# Altium project MotorControl-V4.5.PrjPCB
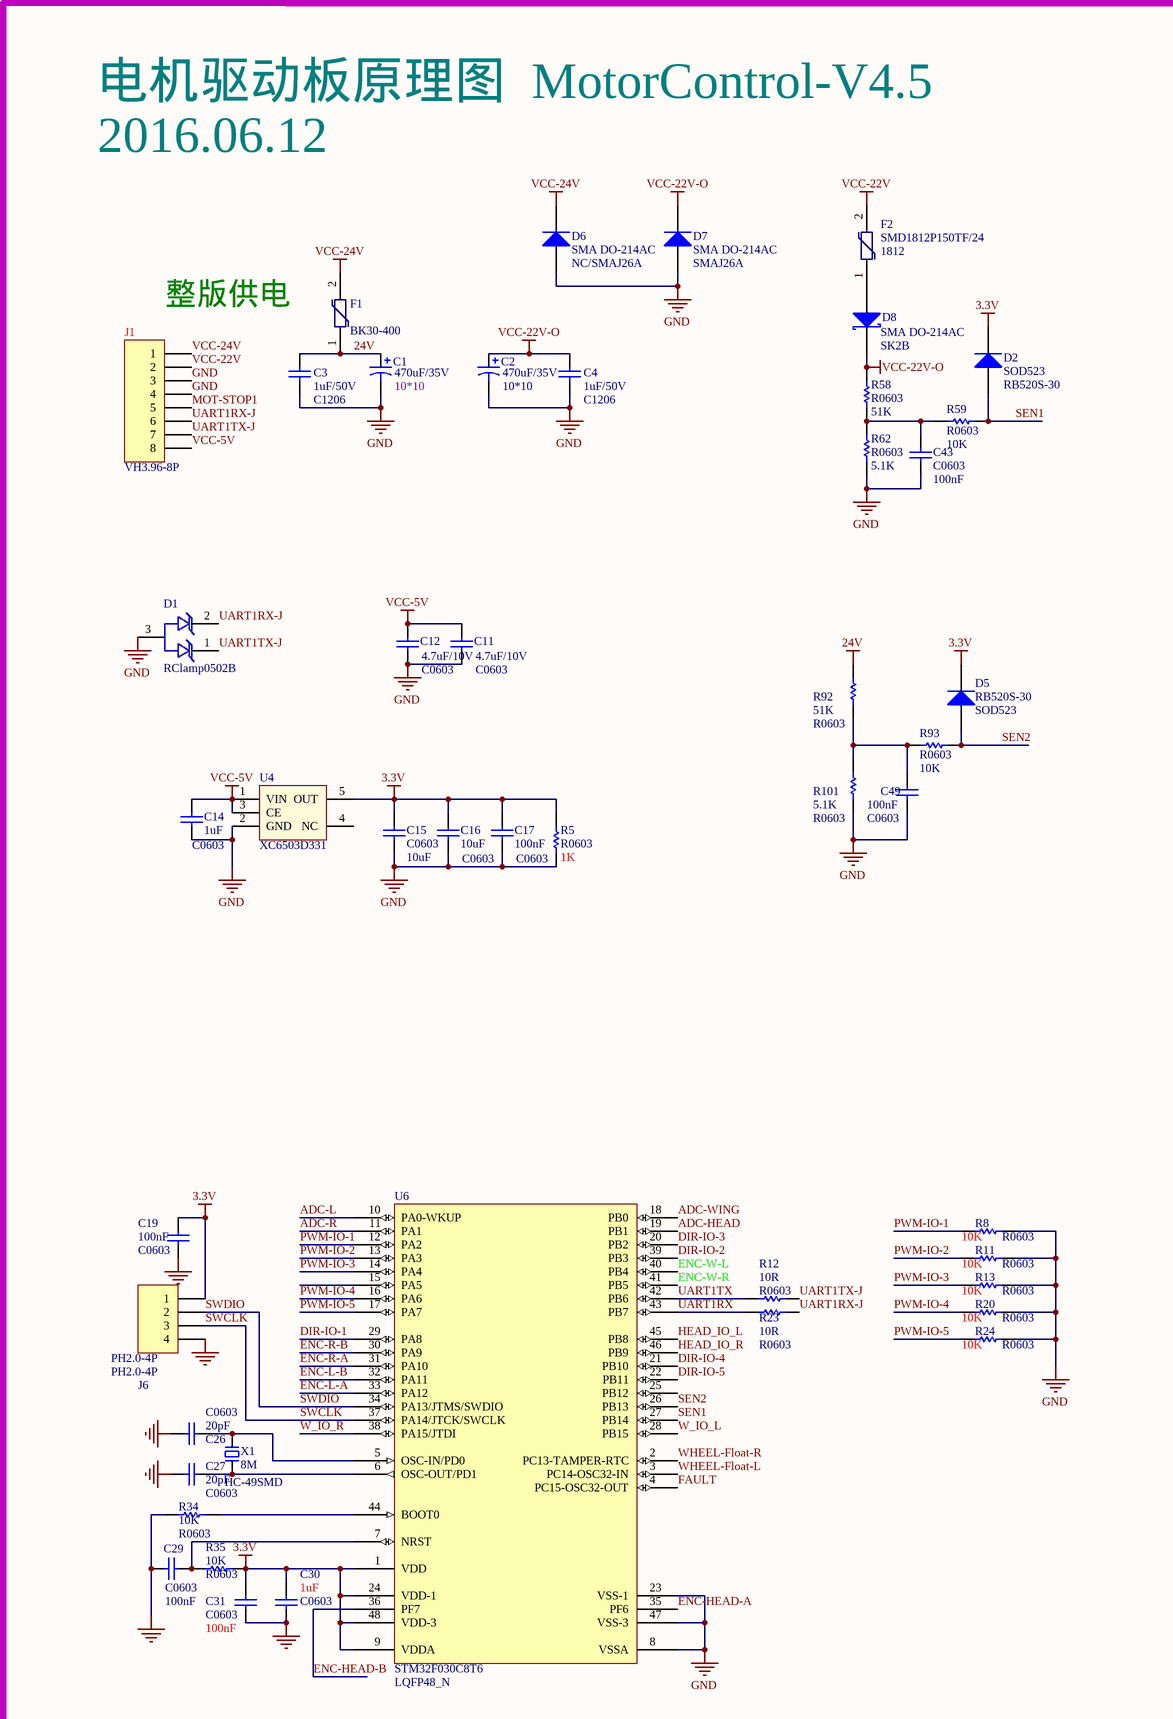
[diagram p0: MotorControlV4.5.SchDoc, top left]
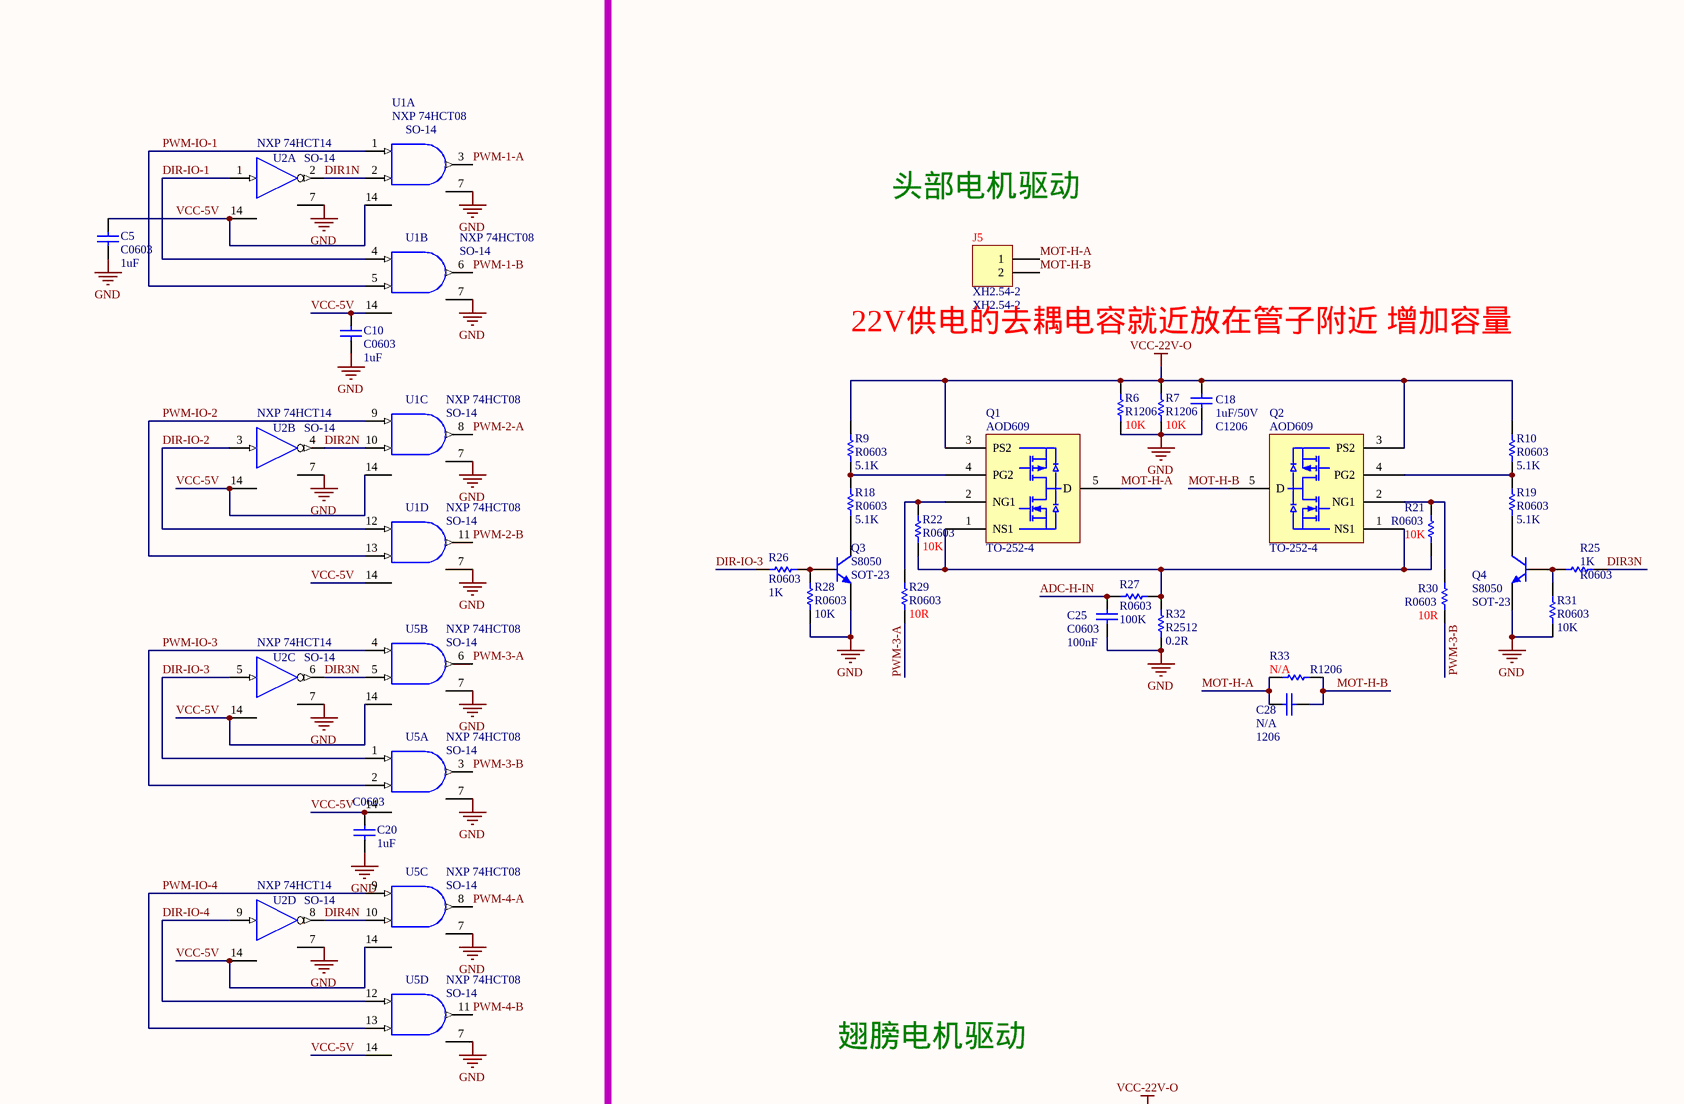
[diagram p1: MotorControlV4.5.SchDoc, top middle]
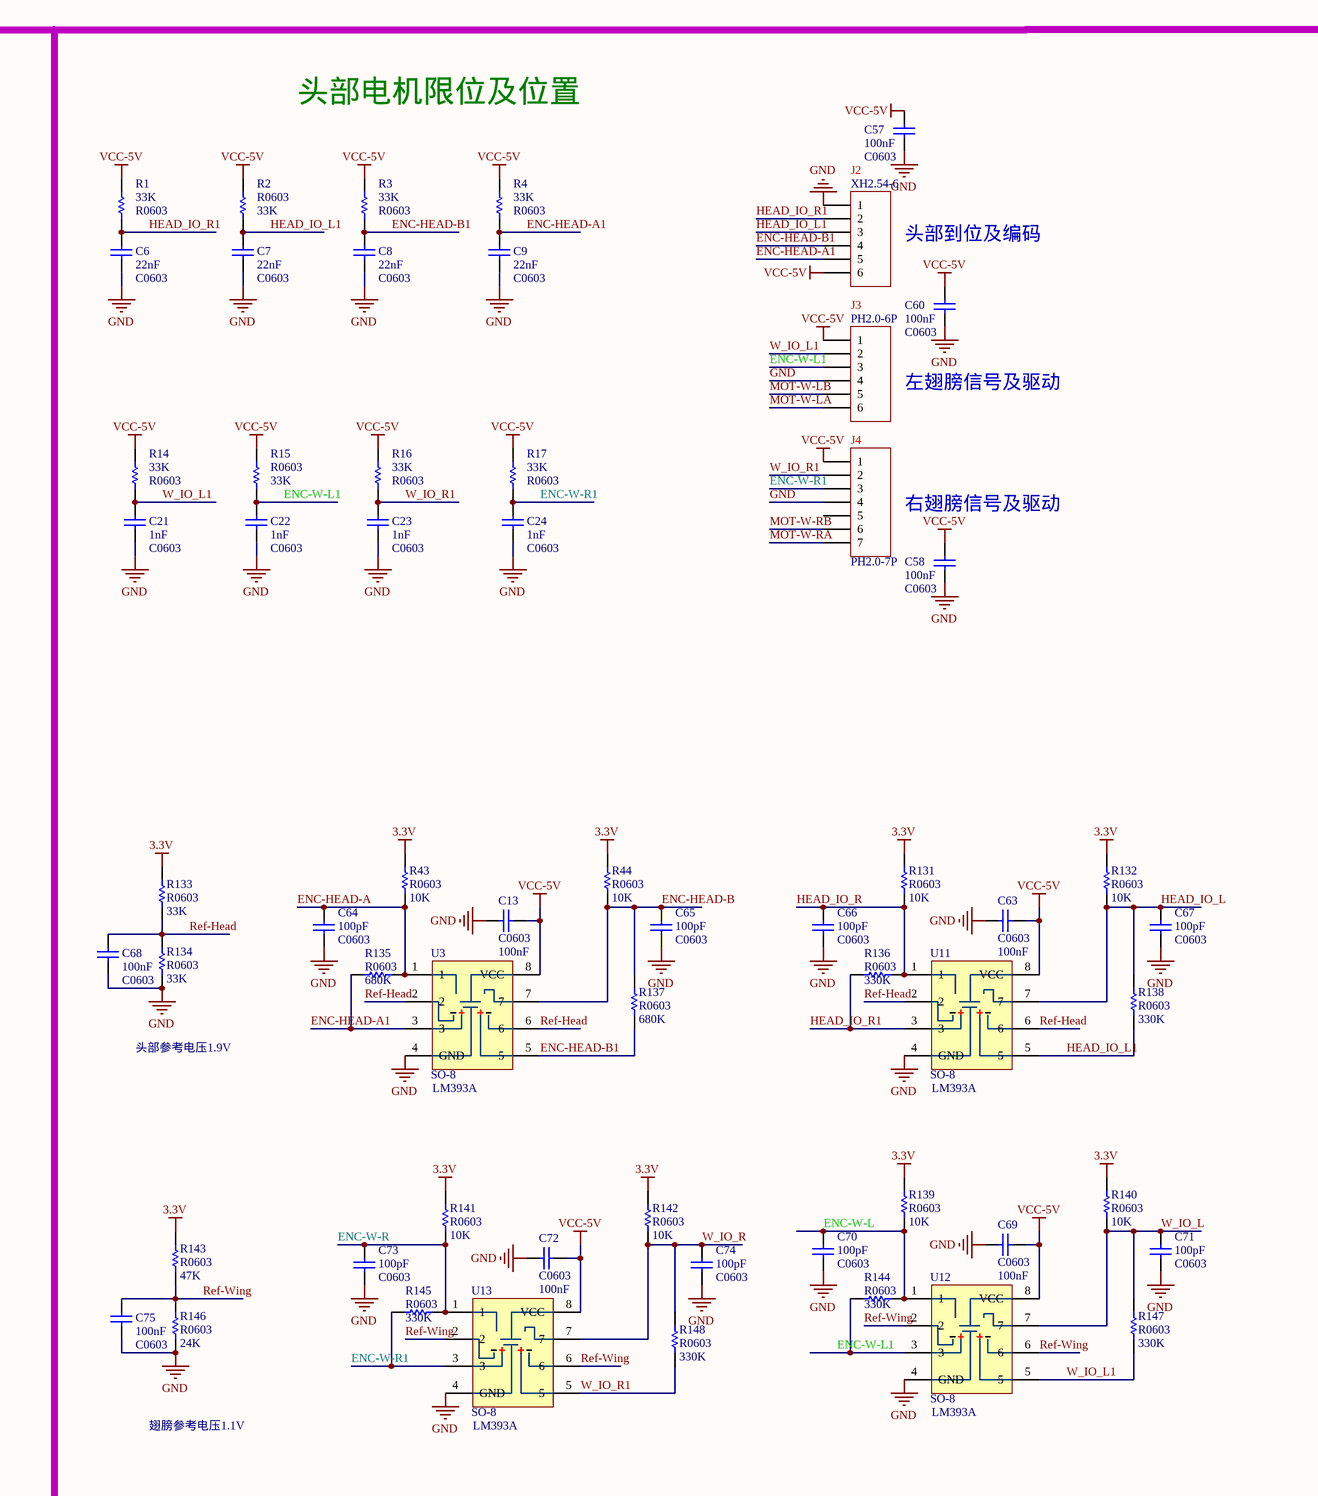
[diagram p2: MotorControlV4.5.SchDoc, top right]
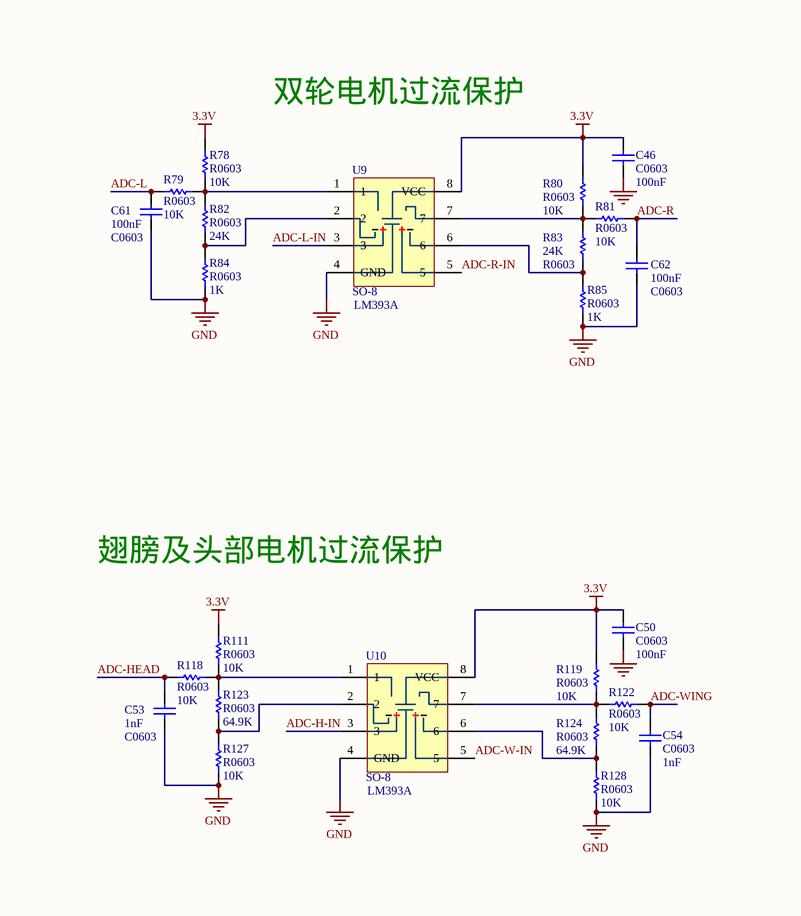
[diagram p3: MotorControlV4.5.SchDoc, bottom left]
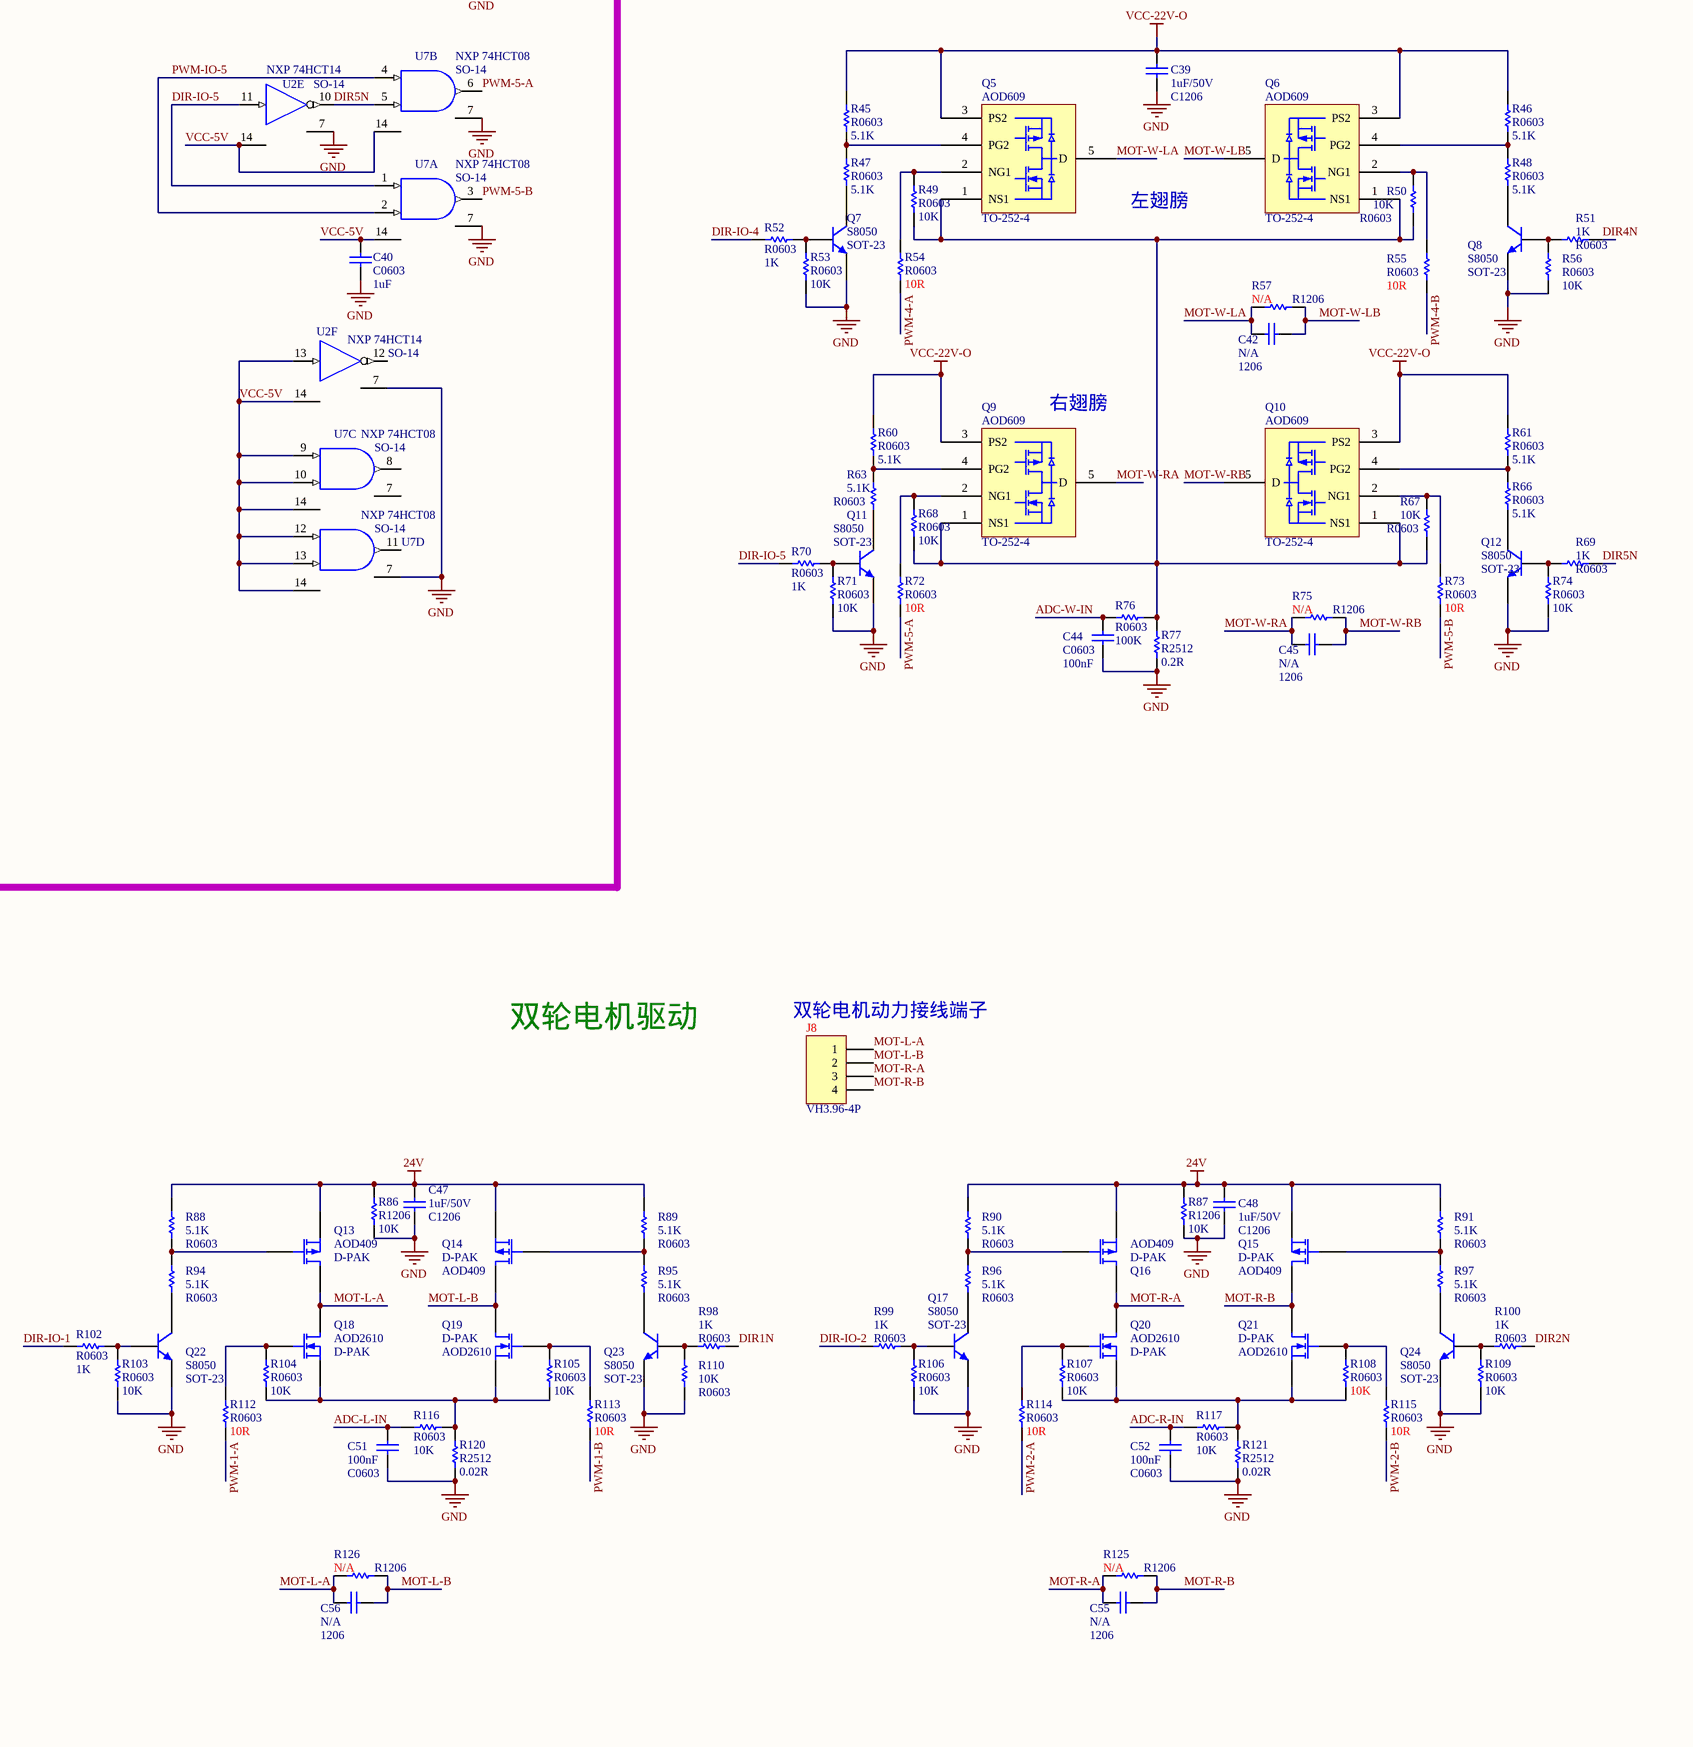
[diagram p4: MotorControlV4.5.SchDoc, bottom middle]
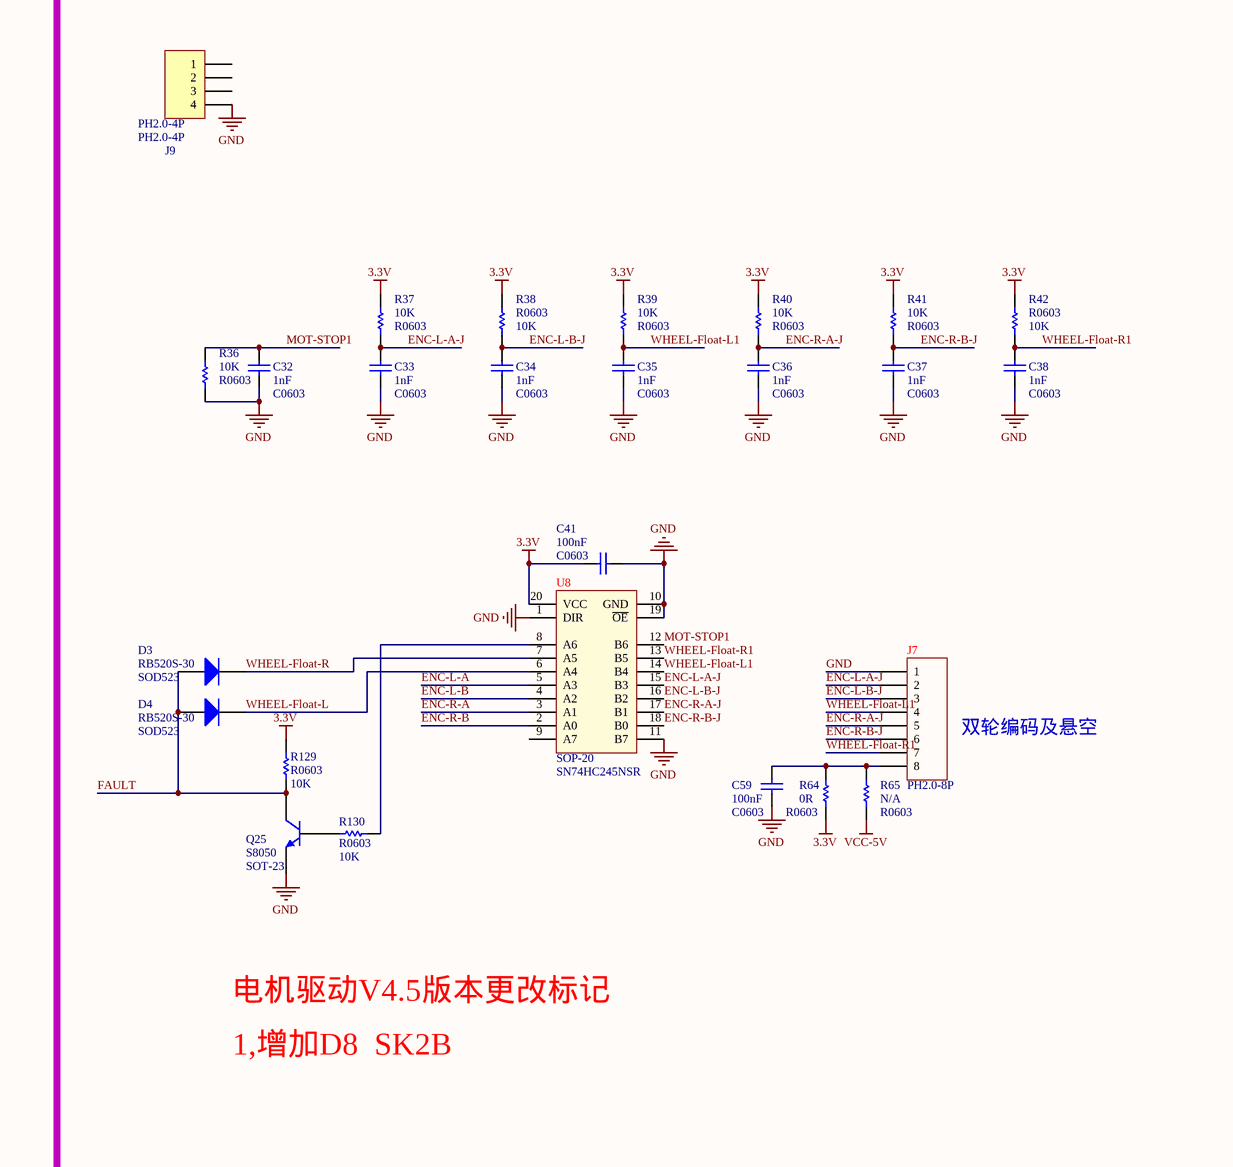
[diagram p5: MotorControlV4.5.SchDoc, bottom right]
1 sheet, 281 parts. Net scope: global (net labels, ports and power ports of the same name join across sheets).
Board file: MotorControl-V4.5.PcbDoc

## Sheet MotorControlV4.5.SchDoc
size 889 x 584 mm

### Parts
C1  470uF/35V  value 10*10  [CAP_SO_10*10]
C2  470uF/35V  value 10*10  [CAP_SO_10*10]
C3  C1206  value 1uF/50V  [1206]
C4  C1206  value 1uF/50V  [1206]
C5  C0603  value 1uF  [C0603_M1608]
C6  C0603  value 22nF  [C0603_M1608]
C7  C0603  value 22nF  [C0603_M1608]
C8  C0603  value 22nF  [C0603_M1608]
C9  C0603  value 22nF  [C0603_M1608]
C10  C0603  value 1uF  [C0603_M1608]
C11  C0603  value 4.7uF/10V  [C0603_M1608]
C12  C0603  value 4.7uF/10V  [C0603_M1608]
C13  C0603  value 100nF  [C0603_M1608]
C14  C0603  value 1uF  [C0603_M1608]
C15  C0603  value 10uF  [C0603_M1608]
C16  C0603  value 10uF  [C0603_M1608]
C17  C0603  value 100nF  [C0603_M1608]
C18  C1206  value 1uF/50V  [1206]
C19  C0603  value 100nF  [C0603_M1608]
C20  C0603  value 1uF  [C0603_M1608]
C21  C0603  value 1nF  [C0603_M1608]
C22  C0603  value 1nF  [C0603_M1608]
C23  C0603  value 1nF  [C0603_M1608]
C24  C0603  value 1nF  [C0603_M1608]
C25  C0603  value 100nF  [C0603_M1608]
C26  C0603  value 20pF  [C0603_M1608]
C27  C0603  value 20pF  [C0603_M1608]
C28  1206  [1206]
C29  C0603  value 100nF  [C0603_M1608]
C30  C0603  value 1uF  [C0603_M1608]
C31  C0603  value 100nF  [C0603_M1608]
C32  C0603  value 1nF  [C0603_M1608]
C33  C0603  value 1nF  [C0603_M1608]
C34  C0603  value 1nF  [C0603_M1608]
C35  C0603  value 1nF  [C0603_M1608]
C36  C0603  value 1nF  [C0603_M1608]
C37  C0603  value 1nF  [C0603_M1608]
C38  C0603  value 1nF  [C0603_M1608]
C39  C1206  value 1uF/50V  [1206]
C40  C0603  value 1uF  [C0603_M1608]
C41  C0603  value 100nF  [C0603_M1608]
C42  1206  [1206]
C43  C0603  value 100nF  [C0603_M1608]
C44  C0603  value 100nF  [C0603_M1608]
C45  1206  [1206]
C46  C0603  value 100nF  [C0603_M1608]
C47  C1206  value 1uF/50V  [1206]
C48  C1206  value 1uF/50V  [1206]
C49  C0603  value 100nF  [C0603_M1608]
C50  C0603  value 100nF  [C0603_M1608]
C51  C0603  value 100nF  [C0603_M1608]
C52  C0603  value 100nF  [C0603_M1608]
C53  C0603  value 1nF  [C0603_M1608]
C54  C0603  value 1nF  [C0603_M1608]
C55  1206  [1206]
C56  1206  [1206]
C57  C0603  value 100nF  [C0603_M1608]
C58  C0603  value 100nF  [C0603_M1608]
C59  C0603  value 100nF  [C0603_M1608]
C60  C0603  value 100nF  [C0603_M1608]
C61  C0603  value 100nF  [C0603_M1608]
C62  C0603  value 100nF  [C0603_M1608]
C63  C0603  value 100nF  [C0603_M1608]
C64  C0603  value 100pF  [C0603_M1608]
C65  C0603  value 100pF  [C0603_M1608]
C66  C0603  value 100pF  [C0603_M1608]
C67  C0603  value 100pF  [C0603_M1608]
C68  C0603  value 100nF  [C0603_M1608]
C69  C0603  value 100nF  [C0603_M1608]
C70  C0603  value 100pF  [C0603_M1608]
C71  C0603  value 100pF  [C0603_M1608]
C72  C0603  value 100nF  [C0603_M1608]
C73  C0603  value 100pF  [C0603_M1608]
C74  C0603  value 100pF  [C0603_M1608]
C75  C0603  value 100nF  [C0603_M1608]
D1  RClamp0502B  [SOT-523]
D2  SOD523  value RB520S-30  [SOD523]
D3  SOD523  value RB520S-30  [SOD523]
D4  SOD523  value RB520S-30  [SOD523]
D5  SOD523  value RB520S-30  [SOD523]
D6  SMA DO-214AC  value NC/SMAJ26A  [SMA DO-214AC]
D7  SMA DO-214AC  value SMAJ26A  [SMA DO-214AC]
D8  SMA DO-214AC  value SK2B  [SMA DO-214AC]
F1  BK30-400  [FUSE-FRG-5MM]
F2  1812  value SMD1812P150TF/24  [1812]
J1  VH3.96-8P  [VH3.96-8P]
J2  XH2.54-6  [XH2.54-6]
J3  PH2.0-6P  [PH2.0-6P]
J4  PH2.0-7P  [PH2.0-7P]
J5  XH2.54-2  [XH2.54-2]
J6  PH2.0-4P  [PH2.0-4P]
J7  PH2.0-8P  [PH2.0-8P]
J8  VH3.96-4P  [VH3.96-4P]
J9  PH2.0-4P  [PH2.0-4P]
Q1  TO-252-4  value AOD609  [TO-252-4L]
Q2  TO-252-4  value AOD609  [TO-252-4L]
Q3  SOT-23  value S8050  [SOT-23_L]
Q4  SOT-23  value S8050  [SOT-23_L]
Q5  TO-252-4  value AOD609  [TO-252-4L]
Q6  TO-252-4  value AOD609  [TO-252-4L]
Q7  SOT-23  value S8050  [SOT-23_L]
Q8  SOT-23  value S8050  [SOT-23_L]
Q9  TO-252-4  value AOD609  [TO-252-4L]
Q10  TO-252-4  value AOD609  [TO-252-4L]
Q11  SOT-23  value S8050  [SOT-23_L]
Q12  SOT-23  value S8050  [SOT-23_L]
Q13  D-PAK  value AOD409  [TO-252-2L]
Q14  D-PAK  value AOD409  [TO-252-2L]
Q15  D-PAK  value AOD409  [TO-252-2L]
Q16  D-PAK  value AOD409  [TO-252-2L]
Q17  SOT-23  value S8050  [SOT-23_L]
Q18  D-PAK  value AOD2610  [TO-252-2L]
Q19  D-PAK  value AOD2610  [TO-252-2L]
Q20  D-PAK  value AOD2610  [TO-252-2L]
Q21  D-PAK  value AOD2610  [TO-252-2L]
Q22  SOT-23  value S8050  [SOT-23_L]
Q23  SOT-23  value S8050  [SOT-23_L]
Q24  SOT-23  value S8050  [SOT-23_L]
Q25  SOT-23  value S8050  [SOT-23_L]
R1  R0603  value 33K  [0603]
R2  R0603  value 33K  [0603]
R3  R0603  value 33K  [0603]
R4  R0603  value 33K  [0603]
R5  R0603  value 1K  [0603]
R6  R1206  value 10K  [1206]
R7  R1206  value 10K  [1206]
R8  R0603  value 10K  [0603]
R9  R0603  value 5.1K  [0603]
R10  R0603  value 5.1K  [0603]
R11  R0603  value 10K  [0603]
R12  R0603  value 10R  [0603]
R13  R0603  value 10K  [0603]
R14  R0603  value 33K  [0603]
R15  R0603  value 33K  [0603]
R16  R0603  value 33K  [0603]
R17  R0603  value 33K  [0603]
R18  R0603  value 5.1K  [0603]
R19  R0603  value 5.1K  [0603]
R20  R0603  value 10K  [0603]
R21  R0603  value 10K  [0603]
R22  R0603  value 10K  [0603]
R23  R0603  value 10R  [0603]
R24  R0603  value 10K  [0603]
R25  R0603  value 1K  [0603]
R26  R0603  value 1K  [0603]
R27  R0603  value 100K  [0603]
R28  R0603  value 10K  [0603]
R29  R0603  value 10R  [0603]
R30  R0603  value 10R  [0603]
R31  R0603  value 10K  [0603]
R32  R2512  value 0.2R  [R2512]
R33  R1206  [1206]
R34  R0603  value 10K  [0603]
R35  R0603  value 10K  [0603]
R36  R0603  value 10K  [0603]
R37  R0603  value 10K  [0603]
R38  R0603  value 10K  [0603]
R39  R0603  value 10K  [0603]
R40  R0603  value 10K  [0603]
R41  R0603  value 10K  [0603]
R42  R0603  value 10K  [0603]
R43  R0603  value 10K  [0603]
R44  R0603  value 10K  [0603]
R45  R0603  value 5.1K  [0603]
R46  R0603  value 5.1K  [0603]
R47  R0603  value 5.1K  [0603]
R48  R0603  value 5.1K  [0603]
R49  R0603  value 10K  [0603]
R50  R0603  value 10K  [0603]
R51  R0603  value 1K  [0603]
R52  R0603  value 1K  [0603]
R53  R0603  value 10K  [0603]
R54  R0603  value 10R  [0603]
R55  R0603  value 10R  [0603]
R56  R0603  value 10K  [0603]
R57  R1206  [1206]
R58  R0603  value 51K  [0603]
R59  R0603  value 10K  [0603]
R60  R0603  value 5.1K  [0603]
R61  R0603  value 5.1K  [0603]
R62  R0603  value 5.1K  [0603]
R63  R0603  value 5.1K  [0603]
R64  R0603  value 0R  [0603]
R65  R0603  [0603]
R66  R0603  value 5.1K  [0603]
R67  R0603  value 10K  [0603]
R68  R0603  value 10K  [0603]
R69  R0603  value 1K  [0603]
R70  R0603  value 1K  [0603]
R71  R0603  value 10K  [0603]
R72  R0603  value 10R  [0603]
R73  R0603  value 10R  [0603]
R74  R0603  value 10K  [0603]
R75  R1206  [1206]
R76  R0603  value 100K  [0603]
R77  R2512  value 0.2R  [R2512]
R78  R0603  value 10K  [0603]
R79  R0603  value 10K  [0603]
R80  R0603  value 10K  [0603]
R81  R0603  value 10K  [0603]
R82  R0603  value 24K  [0603]
R83  R0603  value 24K  [0603]
R84  R0603  value 1K  [0603]
R85  R0603  value 1K  [0603]
R86  R1206  value 10K  [1206]
R87  R1206  value 10K  [1206]
R88  R0603  value 5.1K  [0603]
R89  R0603  value 5.1K  [0603]
R90  R0603  value 5.1K  [0603]
R91  R0603  value 5.1K  [0603]
R92  R0603  value 51K  [0603]
R93  R0603  value 10K  [0603]
R94  R0603  value 5.1K  [0603]
R95  R0603  value 5.1K  [0603]
R96  R0603  value 5.1K  [0603]
R97  R0603  value 5.1K  [0603]
R98  R0603  value 1K  [0603]
R99  R0603  value 1K  [0603]
R100  R0603  value 1K  [0603]
R101  R0603  value 5.1K  [0603]
R102  R0603  value 1K  [0603]
R103  R0603  value 10K  [0603]
R104  R0603  value 10K  [0603]
R105  R0603  value 10K  [0603]
R106  R0603  value 10K  [0603]
R107  R0603  value 10K  [0603]
R108  R0603  value 10K  [0603]
R109  R0603  value 10K  [0603]
R110  R0603  value 10K  [0603]
R111  R0603  value 10K  [0603]
R112  R0603  value 10R  [0603]
R113  R0603  value 10R  [0603]
R114  R0603  value 10R  [0603]
R115  R0603  value 10R  [0603]
R116  R0603  value 10K  [0603]
R117  R0603  value 10K  [0603]
R118  R0603  value 10K  [0603]
R119  R0603  value 10K  [0603]
R120  R2512  value 0.02R  [R2512]
R121  R2512  value 0.02R  [R2512]
R122  R0603  value 10K  [0603]
R123  R0603  value 64.9K  [0603]
R124  R0603  value 64.9K  [0603]
R125  R1206  [1206]
R126  R1206  [1206]
R127  R0603  value 10K  [0603]
R128  R0603  value 10K  [0603]
R129  R0603  value 10K  [0603]
R130  R0603  value 10K  [0603]
R131  R0603  value 10K  [0603]
R132  R0603  value 10K  [0603]
R133  R0603  value 33K  [0603]
R134  R0603  value 33K  [0603]
R135  R0603  value 680K  [0603]
R136  R0603  value 330K  [0603]
R137  R0603  value 680K  [0603]
R138  R0603  value 330K  [0603]
R139  R0603  value 10K  [0603]
R140  R0603  value 10K  [0603]
R141  R0603  value 10K  [0603]
R142  R0603  value 10K  [0603]
R143  R0603  value 47K  [0603]
R144  R0603  value 330K  [0603]
R145  R0603  value 330K  [0603]
R146  R0603  value 24K  [0603]
R147  R0603  value 330K  [0603]
R148  R0603  value 330K  [0603]
U1  SO-14  value NXP 74HCT08  [SO-14]  (parts A,B,C,D of 4)
U2  SO-14  value NXP 74HCT14  [SO-14]  (parts A,B,C,D,E,F of 6)
U3  SO-8  value LM393A  [SO-8]
U4  XC6503D331  [SOT23-5]
U5  SO-14  value NXP 74HCT08  [SO-14]  (parts A,B,C,D of 4)
U6  LQFP48_N  value STM32F030C8T6  [LQFP48_N]
U7  SO-14  value NXP 74HCT08  [SO-14]  (parts A,B,C,D of 4)
U8  SOP-20  value SN74HC245NSR  [SOP-20]
U9  SO-8  value LM393A  [SO-8]
U10  SO-8  value LM393A  [SO-8]
U11  SO-8  value LM393A  [SO-8]
U12  SO-8  value LM393A  [SO-8]
U13  SO-8  value LM393A  [SO-8]
X1  8M  value HC-49SMD  [HC-49SMD]

### Nets
3.3V: C15.1 C16.2 C17.2 C19.1 C30.1 C31.1 C41.1 C46.1 C50.1 D2.2(K) D5.2(K) J6.1 R5.2 R35.2 R37.2 R38.2 R39.2 R40.2 R41.2 R42.2 R43.2 R44.2 R64.2 R78.1 R80.1 R111.2 R119.2 R129.1 R131.2 R132.2 R133.2 R139.2 R140.2 R141.2 R142.2 R143.2 U4.5(OUT) U6.1(VDD) U6.9(VDDA) U6.24(VDD-1) U6.48(VDD-3) U8.20(VCC) U9.8(VCC) U10.8(VCC)
24V: C1.1 C3.1 C47.1 C48.1 F1.1 Q13.2(S) Q14.2(S) Q15.2(S) Q16.2(S) R86.2 R87.2 R88.2 R89.2 R90.2 R91.2 R92.2
GND: C1.2 C2.2 C3.2 C4.2 C5.2 C6.2 C7.2 C8.2 C9.2 C10.2 C11.1 C12.1 C13.1 C14.1 C15.2 C16.1 C17.1 C18.2 C19.2 C20.1 C21.2 C22.2 C23.2 C24.2 C25.2 C26.1 C27.1 C29.1 C30.2 C31.2 C32.2 C33.2 C34.2 C35.2 C36.2 C37.2 C38.2 C39.2 C40.2 C41.2 C43.2 C44.2 C46.2 C47.2 C48.2 C49.2 C50.2 C51.2 C52.2 C53.2 C54.2 C57.2 C58.2 C59.2 C60.2 C61.2 C62.2 C63.1 C64.2 C65.2 C66.2 C67.2 C68.2 C69.1 C70.2 C71.2 C72.1 C73.2 C74.2 C75.2 D1.3 D6.1(A) D7.1(A) J1.3 J1.4 J2.1 J3.4 J4.4 J6.4 J7.1 J9.4 Q3.2(E) Q4.2(E) Q7.2(E) Q8.2(E) Q11.2(E) Q12.2(E) Q17.2(E) Q22.2(E) Q23.2(E) Q24.2(E) Q25.2(E) R5.1 R6.1 R7.1 R8.2 R11.2 R13.2 R20.2 R24.2 R28.1 R31.2 R32.2 R34.1 R36.1 R53.1 R56.1 R62.1 R71.1 R74.1 R77.2 R84.2 R85.2 R86.1 R87.1 R101.1 R103.1 R106.1 R109.1 R110.1 R120.2 R121.2 R127.1 R128.1 R134.1 R146.1 U1.7(GND) U2.7(GND) U3.4(GND) U4.2(GND) U5.7(GND) U6.8(VSSA) U6.23(VSS-1) U6.47(VSS-3) U7.7(GND) U8.1(DIR) U8.10(GND) U8.11(B7) U8.19(~{OE}) U9.4(GND) U10.4(GND) U11.4(GND) U12.4(GND) U13.4(GND)
VCC-5V: C5.1 C10.1 C11.2 C12.2 C13.2 C14.2 C20.2 C40.1 C57.1 C58.1 C60.1 C63.2 C69.2 C72.2 J1.8 J2.6 J3.1 J4.1 R1.2 R2.2 R3.2 R4.2 R14.2 R15.2 R16.2 R17.2 R65.2 U1.14(VCC) U2.13(A) U2.14(VCC) U3.8(VCC) U4.1(VIN) U4.3(CE) U5.14(VCC) U7.9(A) U7.10(B) U7.12(A) U7.13(B) U7.14(VCC) U11.8(VCC) U12.8(VCC) U13.8(VCC)  [also labelled VCC]
VCC-22V: F2.2 J1.2
VCC-22V-O: C2.1 C4.1 C18.1 C39.1 D7.2(K) D8.2(K) Q1.3(PS2) Q2.3(PS2) Q5.3(PS2) Q6.3(PS2) Q9.3(PS2) Q10.3(PS2) R6.2 R7.2 R9.2 R10.2 R45.2 R46.2 R58.2 R60.2 R61.2
VCC-24V: D6.2(K) F1.2 J1.1
ADC-H-IN: C25.1 R27.1 U10.3
ADC-HEAD: C53.1 R118.2 U6.19(PB1)
ADC-L: C61.1 R79.2 U6.10(PA0-WKUP)
ADC-L-IN: C51.1 R116.2 U9.3
ADC-R: C62.1 R81.1 U6.11(PA1)
ADC-R-IN: C52.1 R117.2 U9.5
ADC-W-IN: C44.1 R76.1 U10.5
ADC-WING: C54.1 R122.1 U6.18(PB0)
DIR1N: R98.1 U1.2(B) U2.2(Y)
DIR2N: R100.1 U1.10(B) U2.4(Y)
DIR3N: R25.1 U2.6(Y) U5.5(B)
DIR4N: R51.1 U2.8(Y) U5.10(B)
DIR5N: R69.1 U2.10(Y) U7.5(B)
DIR-IO-1: R102.2 U1.4(A) U2.1(A) U6.29(PA8)
DIR-IO-2: R99.2 U1.12(A) U2.3(A) U6.39(PB3)
DIR-IO-3: R26.2 U2.5(A) U5.1(A) U6.20(PB2)
DIR-IO-4: R52.2 U2.9(A) U5.12(A) U6.21(PB10)
DIR-IO-5: R70.2 U2.11(A) U6.22(PB11) U7.1(A)
ENC-HEAD-A: C64.1 R43.1 R135.1 U3.1 U6.35(PF6)
ENC-HEAD-A1: C9.1 J2.5 R4.1 R135.2 U3.3
ENC-HEAD-B: C65.1 R44.1 R137.1 U3.7 U6.36(PF7)
ENC-HEAD-B1: C8.1 J2.4 R3.1 R137.2 U3.5
ENC-L-A: U6.33(PA12) U8.5(A3)
ENC-L-A-J: C33.1 J7.2 R37.1 U8.15(B3)
ENC-L-B: U6.32(PA11) U8.4(A2)
ENC-L-B-J: C34.1 J7.3 R38.1 U8.16(B2)
ENC-R-A: U6.31(PA10) U8.3(A1)
ENC-R-A-J: C36.1 J7.5 R40.1 U8.17(B1)
ENC-R-B: U6.30(PA9) U8.2(A0)
ENC-R-B-J: C37.1 J7.6 R41.1 U8.18(B0)
ENC-W-L: C70.1 R139.1 R144.1 U6.40(PB4) U12.1
ENC-W-L1: C22.1 J3.3 R15.1 R144.2 U12.3
ENC-W-R: C73.1 R141.1 R145.1 U6.41(PB5) U13.1
ENC-W-R1: C24.1 J4.3 R17.1 R145.2 U13.3
FAULT: D3.1(A) D4.1(A) Q25.3(C) R129.2 U6.4(PC15-OSC32-OUT)
HEAD_IO_L: C67.1 R132.1 R138.1 U6.45(PB8) U11.7
HEAD_IO_L1: C7.1 J2.3 R2.1 R138.2 U11.5
HEAD_IO_R: C66.1 R131.1 R136.1 U6.46(PB9) U11.1
HEAD_IO_R1: C6.1 J2.2 R1.1 R136.2 U11.3
MOT-H-A: C28.2 J5.1 Q1.5(D) R33.2
MOT-H-B: C28.1 J5.2 Q2.5(D) R33.1
MOT-L-A: C56.2 J8.1 Q13.3(D) Q18.3(D) R126.2
MOT-L-B: C56.1 J8.2 Q14.3(D) Q19.3(D) R126.1
MOT-R-A: C55.2 J8.3 Q16.3(D) Q20.3(D) R125.2
MOT-R-B: C55.1 J8.4 Q15.3(D) Q21.3(D) R125.1
MOT-STOP1: C32.1 J1.5 R36.2 U8.12(B6)
MOT-W-LA: C42.2 J3.6 Q5.5(D) R57.2
MOT-W-LB: C42.1 J3.5 Q6.5(D) R57.1
MOT-W-RA: C45.2 J4.7 Q9.5(D) R75.2
MOT-W-RB: C45.1 J4.6 Q10.5(D) R75.1
PWM-1-A: R112.1 U1.3(Y)
PWM-1-B: R113.1 U1.6(Y)
PWM-2-A: R114.1 U1.8(Y)
PWM-2-B: R115.1 U1.11(Y)
PWM-3-A: R29.2 U5.6(Y)
PWM-3-B: R30.2 U5.3(Y)
PWM-4-A: R54.2 U5.8(Y)
PWM-4-B: R55.2 U5.11(Y)
PWM-5-A: R72.2 U7.6(Y)
PWM-5-B: R73.2 U7.3(Y)
PWM-IO-1: R8.1 U1.1(A) U1.5(B) U6.12(PA2)
PWM-IO-2: R11.1 U1.9(A) U1.13(B) U6.13(PA3)
PWM-IO-3: R13.1 U5.2(B) U5.4(A) U6.14(PA4)
PWM-IO-4: R20.1 U5.9(A) U5.13(B) U6.16(PA6)
PWM-IO-5: R24.1 U6.17(PA7) U7.2(B) U7.4(A)
Ref-Head: C68.1 R133.1 R134.2 U3.2 U3.6 U11.2 U11.6
Ref-Wing: C75.1 R143.1 R146.2 U12.2 U12.6 U13.2 U13.6
SEN1: D2.1(A) R59.1 U6.27(PB14)
SEN2: D5.1(A) R93.1 U6.26(PB13)
SWCLK: J6.3 U6.37(PA14/JTCK/SWCLK)
SWDIO: J6.2 U6.34(PA13/JTMS/SWDIO)
UART1RX: R23.1 U6.43(PB7)
UART1RX-J: D1.2 J1.6 R23.2
UART1TX: R12.1 U6.42(PB6)
UART1TX-J: D1.1 J1.7 R12.2
W_IO_L: C71.1 R140.1 R147.1 U6.28(PB15) U12.7
W_IO_L1: C21.1 J3.2 R14.1 R147.2 U12.5
W_IO_R: C74.1 R142.1 R148.1 U6.38(PA15/JTDI) U13.7
W_IO_R1: C23.1 J4.2 R16.1 R148.2 U13.5
WHEEL-Float-L: D4.2(K) U6.3(PC14-OSC32-IN) U8.6(A4)
WHEEL-Float-L1: C35.1 J7.4 R39.1 U8.14(B4)
WHEEL-Float-R: D3.2(K) U6.2(PC13-TAMPER-RTC) U8.7(A5)
WHEEL-Float-R1: C38.1 J7.7 R42.1 U8.13(B5)
NetC26_2: C26.2 U6.5(OSC-IN/PD0) X1.2
NetC27_2: C27.2 U6.6(OSC-OUT/PD1) X1.1
NetC29_2: C29.2 R35.1 U6.7(NRST)
NetC43_1: C43.1 R58.1 R59.2 R62.2
NetC49_1: C49.1 R92.1 R93.2 R101.2
NetC59_1: C59.1 J7.8 R64.1 R65.1
NetD8_1: D8.1(A) F2.1
NetQ1_1: Q1.1(NS1) Q2.1(NS1) R21.2 R22.2 R27.2 R32.1
NetQ1_2: Q1.2(NG1) R22.1 R29.1
NetQ1_4: Q1.4(PG2) R9.1 R18.2
NetQ2_2: Q2.2(NG1) R21.1 R30.1
NetQ2_4: Q2.4(PG2) R10.1 R19.2
NetQ3_1: Q3.1(B) R26.1 R28.2
NetQ3_3: Q3.3(C) R18.1
NetQ4_1: Q4.1(B) R25.2 R31.1
NetQ4_3: Q4.3(C) R19.1
NetQ5_1: Q5.1(NS1) Q6.1(NS1) Q9.1(NS1) Q10.1(NS1) R49.1 R50.1 R67.1 R68.1 R76.2 R77.1
NetQ5_2: Q5.2(NG1) R49.2 R54.1
NetQ5_4: Q5.4(PG2) R45.1 R47.2
NetQ6_2: Q6.2(NG1) R50.2 R55.1
NetQ6_4: Q6.4(PG2) R46.1 R48.2
NetQ7_1: Q7.1(B) R52.1 R53.2
NetQ7_3: Q7.3(C) R47.1
NetQ8_1: Q8.1(B) R51.2 R56.2
NetQ8_3: Q8.3(C) R48.1
NetQ9_2: Q9.2(NG1) R68.2 R72.1
NetQ9_4: Q9.4(PG2) R60.1 R63.2
NetQ10_2: Q10.2(NG1) R67.2 R73.1
NetQ10_4: Q10.4(PG2) R61.1 R66.2
NetQ11_1: Q11.1(B) R70.1 R71.2
NetQ11_3: Q11.3(C) R63.1
NetQ12_1: Q12.1(B) R69.2 R74.2
NetQ12_3: Q12.3(C) R66.1
NetQ13_1: Q13.1(G) R88.1 R94.2
NetQ14_1: Q14.1(G) R89.1 R95.2
NetQ15_1: Q15.1(G) R91.1 R97.2
NetQ16_1: Q16.1(G) R90.1 R96.2
NetQ17_1: Q17.1(B) R99.1 R106.2
NetQ17_3: Q17.3(C) R96.1
NetQ18_1: Q18.1(G) R104.1 R112.2
NetQ18_2: Q18.2(S) Q19.2(S) R104.2 R105.2 R116.1 R120.1
NetQ19_1: Q19.1(G) R105.1 R113.2
NetQ20_1: Q20.1(G) R107.1 R114.2
NetQ20_2: Q20.2(S) Q21.2(S) R107.2 R108.2 R117.1 R121.1
NetQ21_1: Q21.1(G) R108.1 R115.2
NetQ22_1: Q22.1(B) R102.1 R103.2
NetQ22_3: Q22.3(C) R94.1
NetQ23_1: Q23.1(B) R98.2 R110.2
NetQ23_3: Q23.3(C) R95.1
NetQ24_1: Q24.1(B) R100.2 R109.2
NetQ24_3: Q24.3(C) R97.1
NetQ25_1: Q25.1(B) R130.1
NetR34_2: R34.2 U6.44(BOOT0)
NetR78_2: R78.2 R79.1 R82.1 U9.1
NetR80_2: R80.2 R81.2 R83.1 U9.7
NetR82_2: R82.2 R84.1 U9.2
NetR83_2: R83.2 R85.1 U9.6
NetR111_1: R111.1 R118.1 R123.2 U10.1
NetR119_1: R119.1 R122.2 R124.2 U10.7
NetR123_1: R123.1 R127.2 U10.2
NetR124_1: R124.1 R128.2 U10.6
NetR130_2: R130.2 U8.8(A6)

Not connected (* = marked no-connect by the designer): J4 5; J9 1 2 3; U2 12(Y); U4 4(NC); U6 15(PA5) 25(PB12); U7 8(Y) 11(Y); U8 9(A7)

### Notes on the sheet
- 头部电机限位及位置
- 电机驱动板原理图  MotorControl-V4.5
- 2016.06.12
- 头部到位及编码
- 头部电机驱动
- (near J1) 整版供电
- (near J5) 22V供电的去耦电容就近放在管子附近 增加容量
- 左翅膀信号及驱动
- 右翅膀信号及驱动
- 头部参考电压1.9V
- 翅膀电机驱动
- 左翅膀
- 翅膀参考电压1.1V
- (near Q9) 右翅膀
- 双轮电机过流保护
- 双轮电机驱动
- (near J8) 双轮电机动力接线端子
- 双轮编码及悬空
- 电机驱动V4.5版本更改标记
- 翅膀及头部电机过流保护
- 1,增加D8  SK2B

### Library data of the parts
C1 C2 = Cap Pol3: Polarized Capacitor (Surface Mount); Published: 8-Jun-2000; LatestRevisionDate: 29-May-2009; LatestRevisionNote: IPC-7351 Footprint Added.; PackageReference: C0805; Publisher: Altium Limited; PackageDescription: Chip Capacitor
C3-C75 = Cap: Capacitor; Published: 8-Jun-2000; LatestRevisionDate: 17-Jul-2002; LatestRevisionNote: Re-released for DXP Platform.; PackageReference: RAD-0.3; Publisher: Altium Limited; PackageDescription: Radial Cap, Thru-Hole; 2 Leads; 0.3 in Pin Spacing
  C28 C42 C45 C55 C56: Value: N/A
D1 = LCTVS: Value: RClamp0502B
D2-D7 = DIODE: Default Diode; Published: 8-Jun-2000; LatestRevisionDate: 17-Jul-2002; LatestRevisionNote: Re-released for DXP Platform.; PackageDocument: Sep-1996; PackageReference: SMC; Publisher: Altium Limited; Code_JEDEC: DO-214-AB
D8 = D Schottky: Schottky Diode; Published: 8-Jun-2000; LatestRevisionDate: 17-Jul-2002; LatestRevisionNote: Re-released for DXP Platform.; PackageReference: SMB; Publisher: Altium Limited; Code_JEDEC: DO-214-AA
F1 F2 = PPTC
  F1: Value: BK30-400
J2 J3 = PH2.0-6P: Header, 6-Pin; LatestRevisionDate: 17-Jul-2002; LatestRevisionNote: Re-released for DXP Platform.; Publisher: Altium Limited
  J2: Value: XH2.54-6
  J3: Value: PH2.0-6P
J4 = PH2.0-7P: Header, 7-Pin; LatestRevisionDate: 17-Jul-2002; LatestRevisionNote: Re-released for DXP Platform.; Publisher: Altium Limited; Value: PH2.0-7P
J5 = XH2P: Header, 2-Pin; LatestRevisionDate: 17-Jul-2002; LatestRevisionNote: Re-released for DXP Platform.; Publisher: Altium Limited; Value: XH2.54-2
J6 J9 = Header 4: Header, 4-Pin; LatestRevisionDate: 17-Jul-2002; LatestRevisionNote: Re-released for DXP Platform.; Publisher: Altium Limited; Value: PH2.0-4P
J7 = PH2.0-8P: Header, 6-Pin; LatestRevisionDate: 17-Jul-2002; LatestRevisionNote: Re-released for DXP Platform.; Publisher: Altium Limited; Value: PH2.0-8P
J8 = VH3.96-4P: Header, 3-Pin; LatestRevisionDate: 17-Jul-2002; LatestRevisionNote: Re-released for DXP Platform.; Publisher: Altium Limited
Q1 Q2 Q5 Q6 Q9 Q10 = MOS-DUAL-N/P
Q3 Q4 Q7 Q8 Q11 Q12 Q17 Q22-Q25 = NPN: NPN Bipolar Transistor; Published: 8-Jun-2000; LatestRevisionDate: 17-Jul-2002; LatestRevisionNote: Re-released for DXP Platform.; PackageReference: TO-226-AA; Publisher: Altium Limited; PackageDescription: TO, Flat Index; 3 In-Line, Axial Leads; Body Dia. 4.8mm; Leads 0.55 x 0.51 mm (max); Code_JEDEC: TO-226-AA
Q13-Q16 = MOS-P: P-Channel MOSFET; Published: 8-Jun-2000; LatestRevisionDate: 17-Jul-2002; LatestRevisionNote: Re-released for DXP Platform.; PackageVersion: 1995/1996; Publisher: Altium Limited; PackageDescription: TO, Flat Index; 3 In-Line, Axial Leads; Body Dia. 4.6mm; Lead Dia. 0.5 mm (max)
Q18-Q21 = MOS-N: N-Channel MOSFET; LatestRevisionDate: 17-Jul-2002; LatestRevisionNote: Re-released for DXP Platform.; PackageVersion: 1995/1996; PackageReference: E3; Publisher: Altium Limited; PackageDescription: TO, Flat Index; 3 In-Line, Axial Leads; Body Dia. 4.6mm; Lead Dia. 0.5 mm (max); Value: *
R1-R148 = Res1: Resistor; Published: 8-Jun-2000; LatestRevisionDate: 17-Jul-2002; LatestRevisionNote: Re-released for DXP Platform.; PackageReference: AXIAL-0.3; Publisher: Altium Limited; PackageDescription: Axial Device, Thru-Hole; 2 Leads; 0.3 in Pin Spacing
  R33 R57 R65 R75 R125 R126: Value: N/A
U1 U5 U7 = SN74AHCT08N: Quadruple 2-Input Positive-AND Gate; Published: 8-Jun-2000; LatestRevisionDate: 04-Mar-2005; LatestRevisionNote: Stylized 3D Model Added.; DatasheetVersion: Oct-1998; PackageVersion: Oct-1995; PackageReference: N014; Publisher: Altium Limited; PackageDescription: DIP; 14 Leads; Row Spacing 7.62 mm; Pitch 2.54 mm; ComponentLink1Description: Manufacturer Link; ComponentLink1URL: http://www.ti.com/; ComponentLink2URL: http://www-s.ti.com/sc/ds/sn74ahct08.pdf; ComponentLink3Description: Packaging Specification; ComponentLink3URL: http://focus.ti.com/lit/ml/mpdi002c/mpdi002c.pdf
U2 = SN74ACT14N: Hex Schmitt-Trigger Inverter; Published: 8-Jun-2000; LatestRevisionDate: 04-Mar-2005; LatestRevisionNote: Stylized 3D Model Added.; DatasheetVersion: Mar-1998; PackageVersion: Oct-1995; PackageReference: N014; Publisher: Altium Limited; PackageDescription: DIP; 14 Leads; Row Spacing 7.62 mm; Pitch 2.54 mm; ComponentLink1Description: Manufacturer Link; ComponentLink1URL: http://www.ti.com/; ComponentLink2URL: http://www-s.ti.com/sc/ds/sn74act14.pdf; ComponentLink3Description: Packaging Specification; ComponentLink3URL: http://focus.ti.com/lit/ml/mpdi002c/mpdi002c.pdf
U3 U9-U13 = OP
U4 = XC6503Dxxx: Value: XC6503D331
U6 = STM32F103C8T6: STM32 ARM-based 32-bit MCU with 64 Kbytes Flash, 48-pin LQFP, Industrial Temperature; Published: *; DatasheetVersion: *; PackageVersion: *; PackageReference: *; Publisher: *; PackageDescription: *; ComponentLink1Description: *; ComponentLink1URL: *; ComponentLink2Description: *; ComponentLink2URL: *
U8 = 74HC245
X1 = XTAL
J1 = VH3.96-8P: Value: VH3.96-8P